# Altium project Easy iot pico.PrjPcb
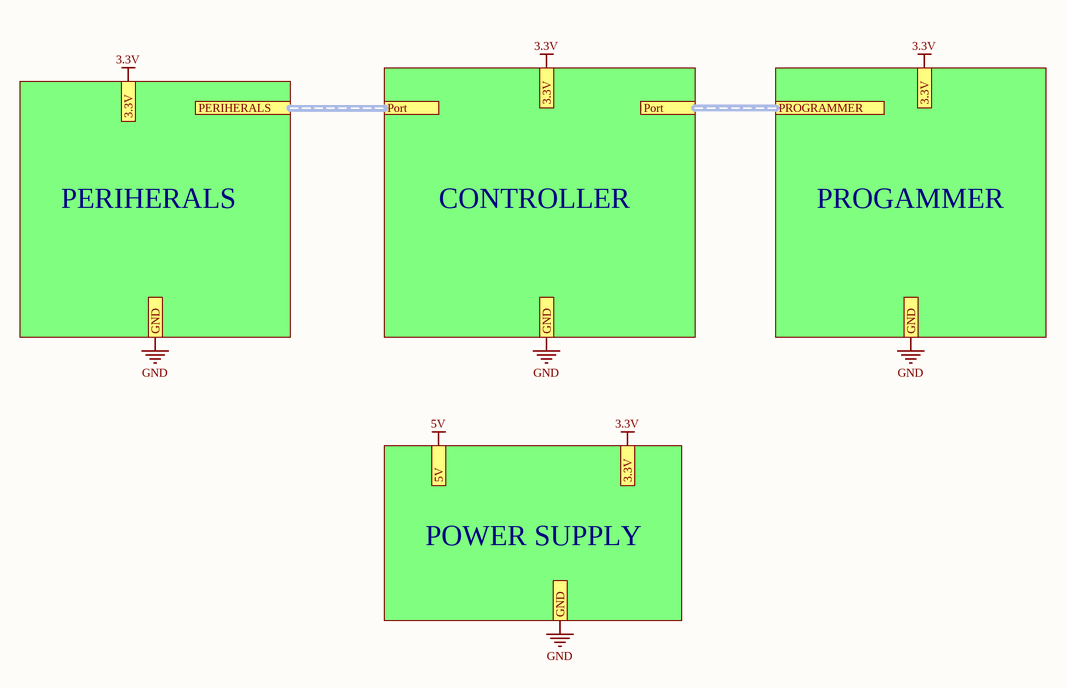
[diagram p0: main.SchDoc]
5 sheets, 43 parts. Net scope: flat (ports and power ports of the same name join across sheets).
Board file: EASYIOTPICO.PcbDoc
Sheets:
  main.SchDoc
    CONTROLLER = controller.SchDoc
    PERIHERALS = INPUT AND OUPUT.SchDoc
    PROGAMMER = Programmer.SchDoc
    POWER SUPPLY = PowerSupply.SchDoc

## Sheet main.SchDoc
size A; SheetNumber: 1

### Sub-sheets
CONTROLLER = controller.SchDoc: no entries
PERIHERALS = INPUT AND OUPUT.SchDoc: no entries
POWER SUPPLY = PowerSupply.SchDoc: no entries
PROGAMMER = Programmer.SchDoc: no entries

### Ports
3.3V, 5V, GND, PERIHERALS (harness PERIHERALS), Port, PROGRAMMER (harness PROGRAMMER)

### Buses and harness runs
harness port PERIHERALS = port Port
harness port Port = port PROGRAMMER

## Sheet controller.SchDoc
size A
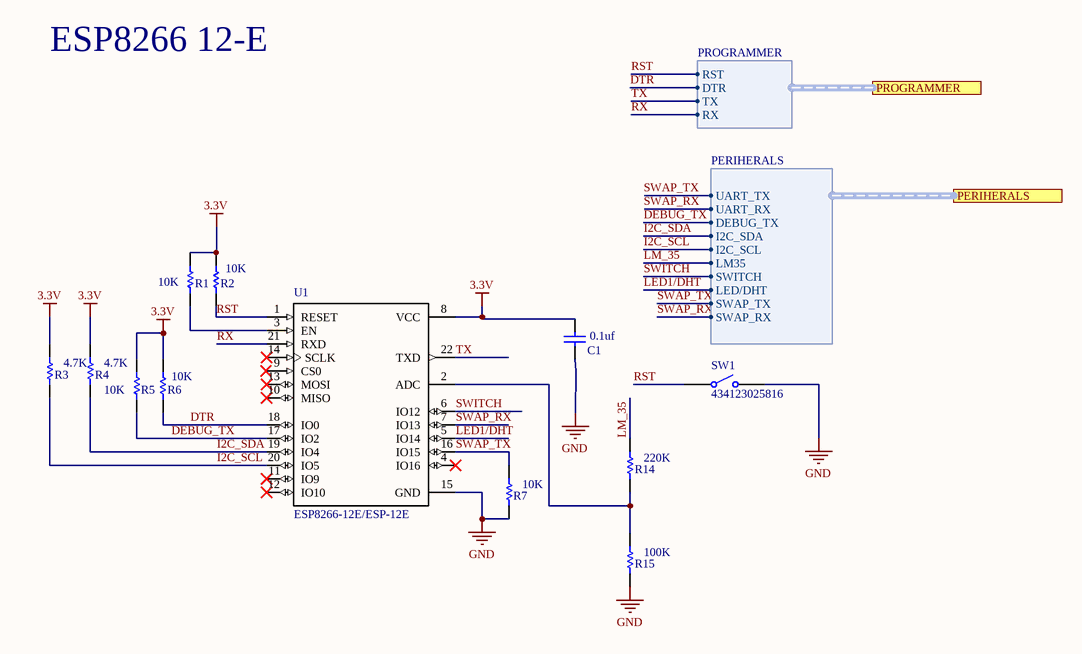
[diagram p1: controller.SchDoc]

### Parts
C1  0.1uf  [CAPC0603]
R1  10K  [RESC0603]
R2  10K  [RESC0603]
R3  4.7K  [RESC0603]
R4  4.7K  [RESC0603]
R5  10K  [RESC0603]
R6  10K  [RESC0603]
R7  10K  [RESC0603]
R14  220K  [RESC0603]
R15  100K  [RESC0603]
SW1  434123025816  [434123025816]
U1  ESP8266-12E/ESP-12E  [*XCVR_ESP8266-12E/ESP-12E]

### Ports
PERIHERALS (harness PERIHERALS), PROGRAMMER (harness PROGRAMMER)

### Harnesses
PROGRAMMER: RST, DTR, TX, RX
PERIHERALS: UART_TX, UART_RX, DEBUG_TX, I2C_SDA, I2C_SCL, LM35, SWITCH, LED/DHT, SWAP_TX, SWAP_RX

### Nets
3.3V: C1.1 R1.2 R2.2 R3.2 R4.2 R5.2 R6.2 U1.8(VCC)
GND: C1.2 R7.1 R15.1 SW1.2 U1.15(GND)
DEBUG_TX: R5.1 U1.17(IO2) ; port PROGRAMMER.DEBUG_TX
DTR: R6.1 U1.18(IO0) ; port PROGRAMMER.DTR
I2C_SCL: R3.1 U1.20(IO5) ; port PROGRAMMER.I2C_SCL
I2C_SDA: R4.1 U1.19(IO4) ; port PROGRAMMER.I2C_SDA
LED1/DHT: U1.5(IO14) ; port PROGRAMMER.LED/DHT
LM_35: R14.2 ; port PROGRAMMER.LM35
RST: R2.1 SW1.1 U1.1(RESET) ; port PROGRAMMER.RST
RX: U1.21(RXD) ; port PROGRAMMER.RX
SWAP_RX: U1.7(IO13) ; port PROGRAMMER.SWAP_RX
SWAP_TX: R7.2 U1.16(IO15) ; port PROGRAMMER.SWAP_TX
SWITCH: U1.6(IO12) ; port PROGRAMMER.SWITCH
TX: U1.22(TXD) ; port PROGRAMMER.TX
NetR1_1: R1.1 U1.3(EN)
NetR14_1: R14.1 R15.2 U1.2(ADC)

Not connected (* = marked no-connect by the designer): U1 4(IO16)* 9(CS0) 10(MISO)* 11(IO9)* 12(IO10)* 13(MOSI)* 14(SCLK)*

### Notes on the sheet
- ESP8266 12-E
- Labels drawn without touching a wire or pin: SWAP_RX, SWAP_TX

### Library data of the parts
C1 = CMP-2007-04765-1: Part Number: 08055C104KAJ2A; Manufacturer: AVX Interconnect / Elco
R1-R7 R14 R15 = CMP-1013-00215-1: 2R55 0.125W 1% 0805 (2012 Metric)  SMD; Case-Metric: 2012; Value: 2.55 Ohm; Case-EIA: 0805; Tolerance: 1 %; Technology: SMT; Power: 0.125 W
SW1 = CMP-1460-00004-1: WS-TASV J-Bend SMD Tact Switch 6.0X3.8 mm; Manufacturer: Wuerth Elektronik; NoPins: 02; ComponentLink2Description: Datasheet; ComponentLink2URL: http://katalog.we-online.de/em/datasheet/434123025816.pdf; ComponentLink1URL: http://www.we-online.com; PartNumber: 434123025816; PackageReference: 434123025816; ComponentLink1Description: Manufacturer URL
U1 = ESP8266-12E/ESP-12E: This WiFi module has a 32-bit MCU micro and clock speeds supporting 80 MHz or 160 MHz. Supports the RTOS and integrated Wi-Fi MAC/BB/RF/PA/LNA, and has an on-board antenna.; MF: AI-Thinker; Availability: Unavailable; MP: ESP8266-12E/ESP-12E; Price: None; SnapEDA_Link: https://www.snapeda.com/parts/ESP8266-12E/ESP-12E/AI-Thinker/view-part/?ref=snap; Package: None; Value: *

## Sheet INPUT AND OUPUT.SchDoc
size A
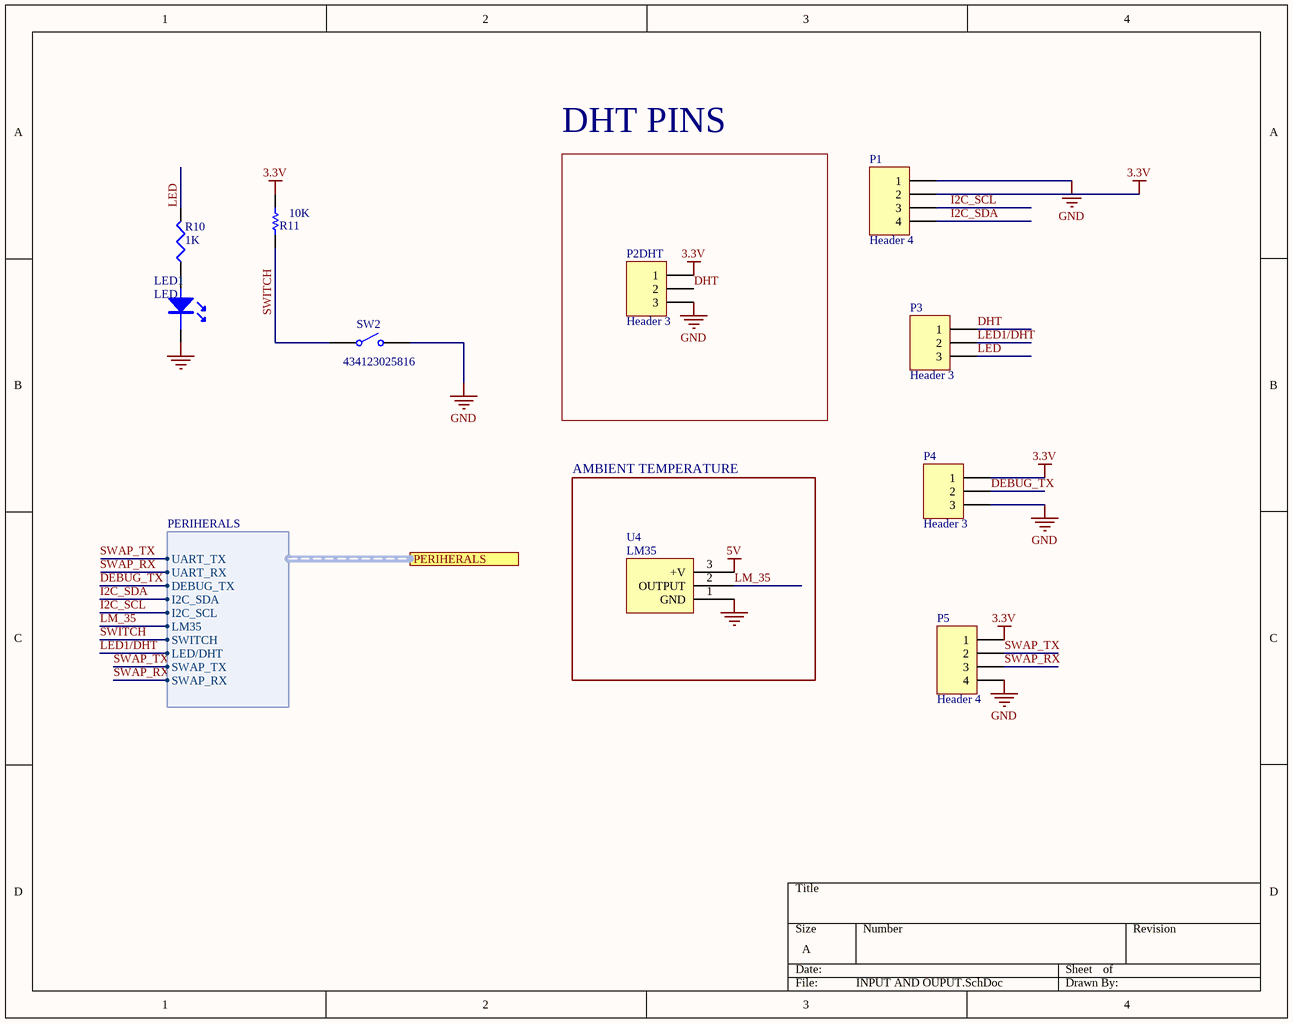
[diagram p2: INPUT AND OUPUT.SchDoc]

### Parts
LED1  LED  [Type 3mm]
P1  Header 4  [HDR1X4]
P2DHT  Header 3  [HDR1X3]
P3  Header 3  [HDR1X3]
P4  Header 3  [HDR1X3]
P5  Header 4  [HDR1X4]
R10  1K  [RESC0603]
R11  10K  [RESC0603]
SW2  434123025816  [434123025816]
U4  LM35  [TO92S]

### Blocks framed on the sheet
DHT PINS: P2DHT
AMBIENT TEMPERATURE: U4

### Ports
PERIHERALS (harness PERIHERALS)

### Harnesses
PERIHERALS: UART_TX, UART_RX, DEBUG_TX, I2C_SDA, I2C_SCL, LM35, SWITCH, LED/DHT, SWAP_TX, SWAP_RX

### Nets
3.3V: P1.2 P2DHT.1 P4.1 P5.1 R11.2
5V: U4.3(+V)
GND: LED1.1(A) P1.1 P2DHT.3 P4.3 P5.4 SW2.2 U4.1(GND)
DEBUG_TX: P4.2 ; port PERIHERALS.DEBUG_TX
DHT: P2DHT.2 P3.1
I2C_SCL: P1.3 ; port PERIHERALS.I2C_SCL
I2C_SDA: P1.4 ; port PERIHERALS.I2C_SDA
LED: P3.3 R10.2
LED1/DHT: P3.2 ; port PERIHERALS.LED/DHT
LM_35: U4.2(OUTPUT) ; port PERIHERALS.LM35
SWAP_RX: P5.3 ; port PERIHERALS.SWAP_RX
SWAP_TX: P5.2 ; port PERIHERALS.SWAP_TX
SWITCH: R11.1 SW2.1 ; port PERIHERALS.SWITCH
NetLED1_2: LED1.2(K) R10.1

### Notes on the sheet
- Labels drawn without touching a wire or pin: SWAP_RX, SWAP_TX

### Library data of the parts
P1 P5 = Header 4: Header, 4-Pin; LatestRevisionDate: 17-Jul-2002; LatestRevisionNote: Re-released for DXP Platform.; Publisher: Altium Limited
P2DHT P3 P4 = Header 3: Header, 3-Pin; LatestRevisionDate: 17-Jul-2002; LatestRevisionNote: Re-released for DXP Platform.; Publisher: Altium Limited
R10 = RES1: RESISTOR
R11 = CMP-1013-00215-1: as R1 on sheet controller; Tolerance: 1 %; Technology: SMT; Power: 0.125 W
SW2 = CMP-1460-00004-1: as SW1 on sheet controller; ComponentLink2Description: Datasheet; ComponentLink2URL: http://katalog.we-online.de/em/datasheet/434123025816.pdf; ComponentLink1URL: http://www.we-online.com; PartNumber: 434123025816; PackageReference: 434123025816; ComponentLink1Description: Manufacturer URL

## Sheet Programmer.SchDoc
size A
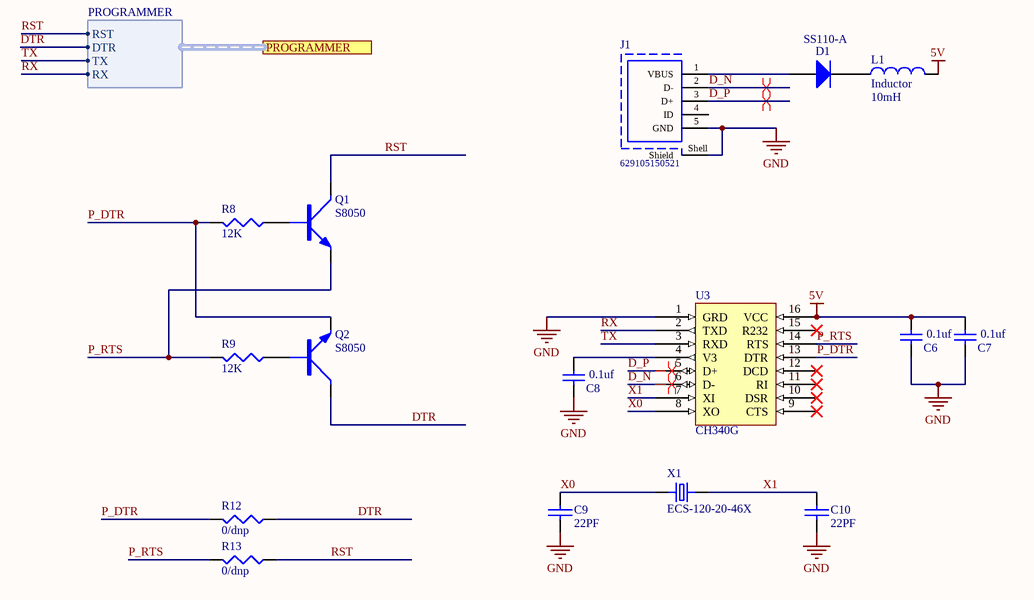
[diagram p3: Programmer.SchDoc]

### Parts
C6  0.1uf  [CAPC0603]
C7  0.1uf  [CAPC0603]
C8  0.1uf  [CAPC0603]
C9  22PF  [CAPC0603]
C10  22PF  [CAPC0603]
D1  SS110-A  [BZT55B13GS08]
J1  629105150521  [629105150521]
L1  Inductor  value 10mH  [CAPC0805]
Q1  S8050  [SOT23-3]
Q2  S8050  [SOT23-3]
R8  12K  [RESC0603]
R9  12K  [RESC0603]
R12  0/dnp  [RESC0603]
R13  0/dnp  [RESC0603]
U3  CH340G  [SOIC16_N]
X1  ECS-120-20-46X  [XTAL_ECS-120-20-46X]

### Ports
PROGRAMMER (harness PROGRAMMER)

### Harnesses
PROGRAMMER: RST, DTR, TX, RX

### Nets
5V: C6.1 C7.1 L1.2 U3.16(VCC)
GND: C6.2 C7.2 C8.2 C9.1 C10.1 J1.5(GND) J1.Shell(Shield) U3.1(GRD)
D_N: J1.2(D-) U3.6(D-)
D_P: J1.3(D+) U3.5(D+)
DTR: Q2.3(COLL) R12.1 ; port PROGRAMMER.DTR
P_DTR: Q2.2(EMIT) R8.2 R12.2 U3.13(DTR)
P_RTS: Q1.2(EMIT) R9.2 R13.2 U3.14(RTS)
RST: Q1.3(COLL) R13.1 ; port PROGRAMMER.RST
RX: U3.2(TXD) ; port PROGRAMMER.RX
TX: U3.3(RXD) ; port PROGRAMMER.TX
X0: C9.2 U3.8(XO) X1.1
X1: C10.2 U3.7(XI) X1.2
NetC8_1: C8.1 U3.4(V3)
NetD1_1: D1.1(A) L1.1
NetD1_2: D1.2(K) J1.1(VBUS)
NetQ1_1: Q1.1(BASE) R8.1
NetQ2_1: Q2.1(BASE) R9.1

Not connected (* = marked no-connect by the designer): J1 4(ID); U3 9(CTS)* 10(DSR)* 11(RI)* 12(DCD)* 15(R232)*

### Layout directives
differential pair: D_N, D_P

### Library data of the parts
C6-C8 = CMP-2007-04765-1: as C1 on sheet controller
C9 C10 = CAP NP
D1 = Diode: Default Diode; Published: 8-Jun-2000; LatestRevisionDate: 17-Jul-2002; LatestRevisionNote: Re-released for DXP Platform.; PackageVersion: Sep-1996; PackageReference: SMC; Publisher: Altium Limited; PackageDescription: DO-214-AB/SMC; 2 C-Bend Leads; Body 7.9 x 5.9 mm, inc. leads (LxW); Code_JEDEC: DO-214-AB
J1 = CMP-1502-03252-1: Micro USB 2.0 Type B Receptacle WR-COM, Horizontal, SMT, with Pegs, High Current at Pin 1 & Pin 5; Manufacturer: Wurth Elektronik; Contact Resistance: 30mOhm; Rated Current: 3A; Working Voltage: 30VAC; Package Reference: 629105150521; Mounting Technology: SMT; Connector Type: MicroUSB2.0TypeB; Operating Temperature: -40to85degC; Orientation: Horizontal; Manufacturer URL: http://www.we-online.de; Datasheet URL: https://katalog.we-online.de/em/datasheet/629105150521.pdf; Part Number: 629105150521; Packaging: TapeandReel; Gender: Receptacle; Publisher: WurthElektronik
L1 = Inductor: Code_IEC: 1005; Published: 8-Jun-2000; LatestRevisionDate: 29-May-2009; LatestRevisionNote: IPC-7351 Footprint Added.; PackageReference: 0402-A; Publisher: Altium Limited; PackageDescription: Chip Inductor; Code_JEITA: 0402
Q1 Q2 = NPN BEC
R8 R9 R12 R13 = RES1: RESISTOR
X1 = ECS-120-20-46X: QUARTZ CRYSTAL  T/H; Value: *

## Sheet PowerSupply.SchDoc
size A
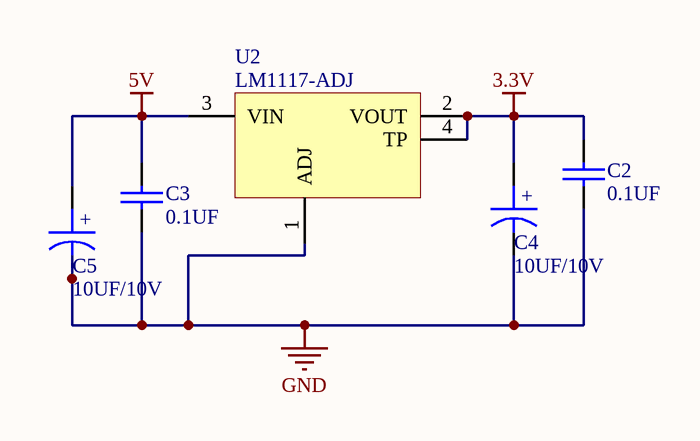
[diagram p4: PowerSupply.SchDoc]

### Parts
C2  0.1UF  [CAPC0603]
C3  0.1UF  [CAPC0603]
C4  10UF/10V  [CAPC1206_TANTALUM]
C5  10UF/10V  [CAPC1206_TANTALUM]
U2  LM1117-ADJ  [SOT223]

### Nets
3.3V: C2.1 C4.1 U2.2(VOUT) U2.4(TP)
5V: C3.1 C5.1 U2.3(VIN)
GND: C2.2 C3.2 C4.2 C5.2 U2.1(ADJ)

### Notes on the sheet
- (in symbol CAP) +

### Library data of the parts
C2 C3 = CAP NP
C4 C5 = CAP
U2 = LM1117-3.3V_ADJ: 3.3V LDO REGULATOR

## Nets that join several sheets
3.3V: controller (8 pins), INPUT AND OUPUT (5 pins), PowerSupply (C2.1 C4.1 U2.2 U2.4)
5V: INPUT AND OUPUT (U4.3), Programmer (C6.1 C7.1 L1.2 U3.16), PowerSupply (C3.1 C5.1 U2.3)
GND: controller (5 pins), INPUT AND OUPUT (7 pins), Programmer (8 pins), PowerSupply (5 pins)
DEBUG_TX: controller (R5.1 U1.17), INPUT AND OUPUT (P4.2)
DTR: controller (R6.1 U1.18), Programmer (Q2.3 R12.1)
I2C_SCL: controller (R3.1 U1.20), INPUT AND OUPUT (P1.3)
I2C_SDA: controller (R4.1 U1.19), INPUT AND OUPUT (P1.4)
LED1/DHT: controller (U1.5), INPUT AND OUPUT (P3.2)
LM_35: controller (R14.2), INPUT AND OUPUT (U4.2)
RST: controller (R2.1 SW1.1 U1.1), Programmer (Q1.3 R13.1)
RX: controller (U1.21), Programmer (U3.2)
SWAP_RX: controller (U1.7), INPUT AND OUPUT (P5.3)
SWAP_TX: controller (R7.2 U1.16), INPUT AND OUPUT (P5.2)
SWITCH: controller (U1.6), INPUT AND OUPUT (R11.1 SW2.1)
TX: controller (U1.22), Programmer (U3.3)